# EAGLE design untitled (EAGLE 9.3.1)
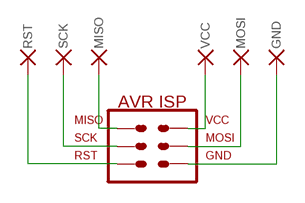
[diagram p0: schematic, sheet 1]

## Parts
GND  GND  POGO_PIN_P50-XX_HORIZONTALLY  [POGO_PIN_P50-XX_HORIZONTALLY]
MISO  MISO  POGO_PIN_P50-XX_HORIZONTALLY  [POGO_PIN_P50-XX_HORIZONTALLY]
MOSI  MOSI  POGO_PIN_P50-XX_HORIZONTALLY  [POGO_PIN_P50-XX_HORIZONTALLY]
RST  RST  POGO_PIN_P50-XX_HORIZONTALLY  [POGO_PIN_P50-XX_HORIZONTALLY]
SCK  SCK  POGO_PIN_P50-XX_HORIZONTALLY  [POGO_PIN_P50-XX_HORIZONTALLY]
VCC  VCC  POGO_PIN_P50-XX_HORIZONTALLY  [POGO_PIN_P50-XX_HORIZONTALLY]
X1  AVR-ISP_10X_IDC_LOCK_EDGE_PCB  [AVR-ISP-10_EDGE_PCB]

## Nets
GND: GND.P$1(P) X1.GND X1.GND1(GND) X1.GND2(GND) X1.GND3(GND)
MISO: MISO.P$1(P) X1.MISO
MOSI: MOSI.P$1(P) X1.MOSI
RST: RST.P$1(P) X1.RST
SCK: SCK.P$1(P) X1.SCK
VCC: VCC.P$1(P) X1.VCC

## Library data of the parts
GND MISO MOSI RST SCK VCC = Emsit-Connectors:POGO_PIN
X1 = Emsit-Connectors:AVR-ISP

## Board
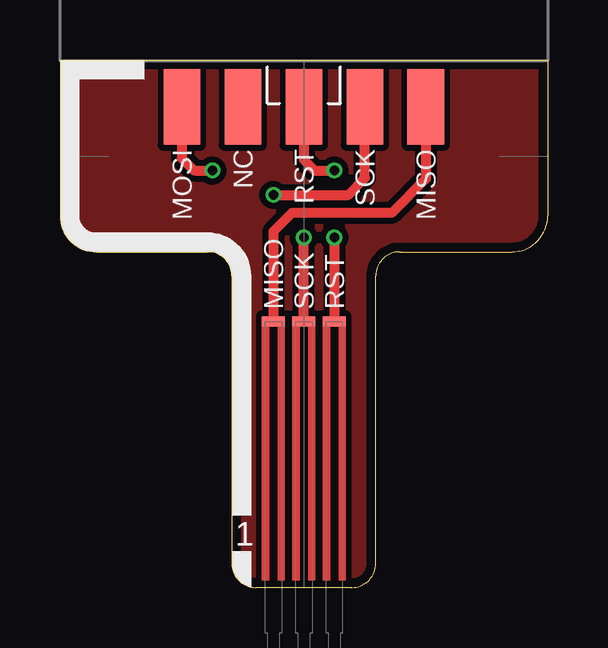
[diagram p1: board, top side]
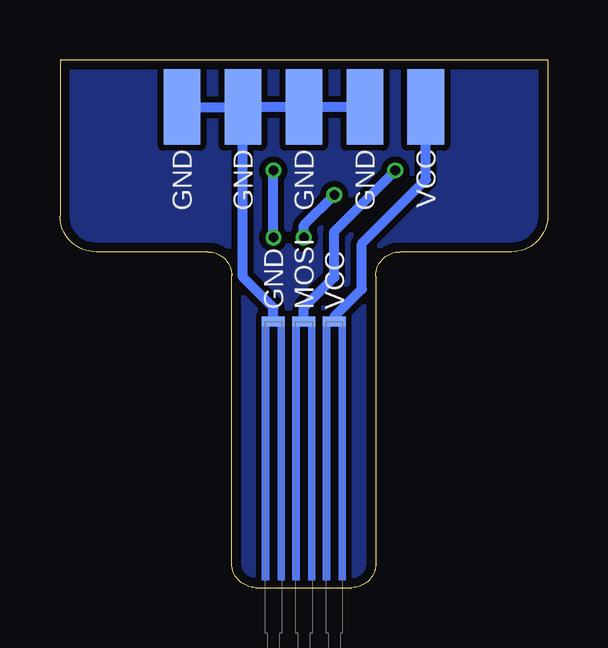
[diagram p2: board, bottom side, seen from below]

Size 20.32 x 22 mm. Coordinates in mm from the lower left corner, seen from the top.
Outline: 20.32,22 20.32,15.5 arc-90 18.82,14 14.16,14 arc90 13.16,13 13.16,1 arc-90 12.16,0 8.16,0 arc-90 7.16,1 7.16,13 arc90 6.16,14 1.5,14 arc-90 0,15.5 0,22 20.32,22
Copper layers (1*16): Top 0.035559375mm / dielectric 1.6mm / Bottom 0.035559375mm
Design rules "default": minimum track width 6mil, minimum drill 10mil, track to track 6mil, track to pad 6mil, pad to pad 6mil, via to via 6mil, smd to smd 6mil, copper to edge 15mil, drill to drill 6mil, minimum pad ring 5mil, minimum via ring 5mil, stop-mask expansion 2.5mil, vias tented up to drill 0.5mm, thermal gap 10mil

### Footprints (pad centres in the part's own frame; a part is rotated, then mirrored left to right if it is on the bottom)
POGO_PIN_P50-XX_HORIZONTALLY = smd 0.95 x 0.41: P$1 0,5.5
AVR-ISP-10_EDGE_PCB = smd 1.524 x 3.15 bottom: GND -2.54,-0.15; GND1 0,-0.15; GND2 2.54,-0.15; GND3 5.08,-0.15; VCC -5.08,-0.15 | smd 1.524 x 3.15: MISO 5.08,-0.15; MOSI -5.08,-0.15; NC -2.54,-0.15; RST 0,-0.15; SCK 2.54,-0.15

### Placement (x,y rotation side)
GND  11.43,5.6 0 bottom
MISO  8.89,5.6 0 top
MOSI  10.16,5.6 0 bottom
RST  11.43,5.6 0 top
SCK  10.16,5.6 0 top
U$1  [6.00X2.53]  18.32,18 90 top
VCC  8.89,5.6 0 bottom
X1  10.16,20.18 0 top

### Tracks (layer width: path | path; a pad name or v marks a point on that pad's centre or on a via)
GND
  Bottom 0.406: X1.GND X1.GND1 X1.GND2 | X1.GND3 X1.GND2 | GND.P$1 11.43,11.68 12.7,12.95 X1.GND2
MISO
  Top 0.406: MISO.P$1 8.89,14.85 9.66,15.62 13.82,15.62 15.24,17.04 X1.MISO
MOSI  (via drill 0.4)
  Top 0.406: 5.08,18.66 X1.MOSI 5.08,17.9 5.59,17.39 v6.35,17.39
  Bottom 0.406: MOSI.P$1 10.16,11.68 8.89,12.95 8.89,14.85 v6.35,17.39
N$1
  pour Top (isolate 0.254): 8.16,0 arc-90 7.16,1 7.16,13 arc90 6.16,14 1.5,14 arc-90 0,15.5 0,22 20.32,22 20.32,15.5 arc-90 18.82,14 14.16,14 arc90 13.16,13 13.16,1 arc-90 12.16,0
N$2
  pour Bottom (isolate 0.254): 8.16,0 arc-90 7.16,1 7.16,13 arc90 6.16,14 1.5,14 arc-90 0,15.5 0,22 20.32,22 20.32,15.5 arc-90 18.82,14 14.16,14 arc90 13.16,13 13.16,1 arc-90 12.16,0
RST  (via drill 0.4)
  Top 0.406: v11.43,14.6 RST.P$1 | X1.RST 10.16,17.84 10.6,17.39 v11.43,17.39
  Bottom 0.406: v11.43,14.6 v11.43,17.39
SCK  (via drill 0.4)
  Top 0.406: SCK.P$1 v10.16,14.6 | X1.SCK 12.7,17.07 12,16.38 v8.89,16.38
  Bottom 0.406: v10.16,14.6 10.16,15.11 v8.89,16.38
VCC
  Bottom 0.406: X1.VCC 5.08,17.01 7.75,14.34 7.75,12.44 8.89,11.29 VCC.P$1

### Text on the board
tPlace: 1
tStop: AVR-ISP / pogo
bStop: 2x5 IDC 2.54mm / 2x3 pogo 1.27mm